# EAGLE design usb-db-revC (EAGLE 9.6.2)
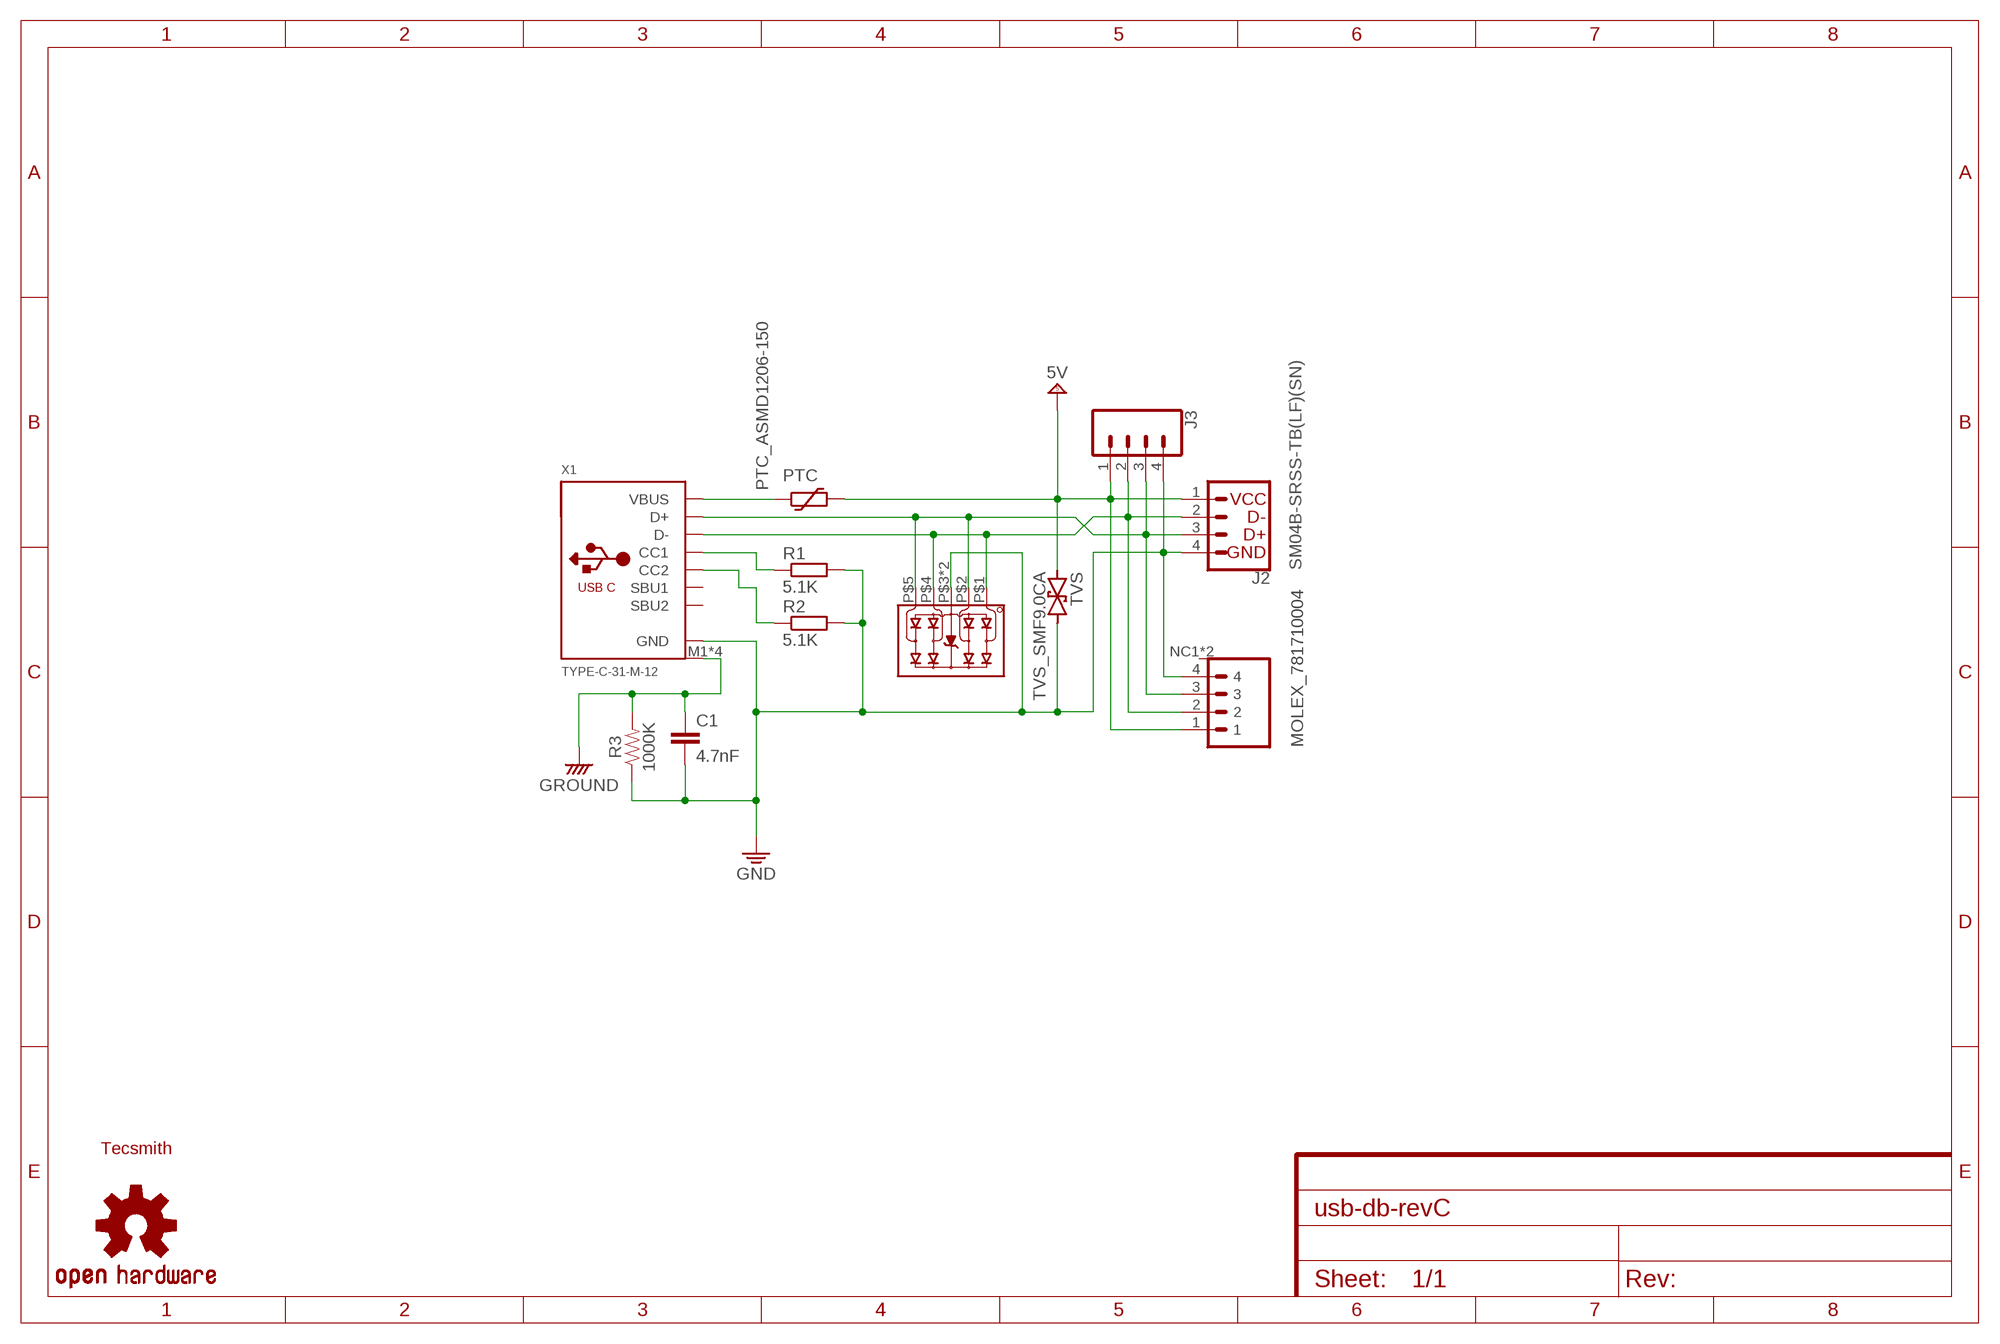
[diagram p0: schematic, sheet 1]

## Parts
C1  4.7nF  0.1UF-0603-25V-5%  [0603]
J2  SM04B-SRSS-TB(LF)(SN)  C3_UNIFIEDJS-1MM  [1X04_1MM_RA]
J3  CONN_04SMD_RA_FEMALE  [1X04_SMD_RA_FEMALE]
LOGO1  OSHW-LOGOS  [OSHW-LOGO-S]
MOLEX_781710004  MOLEX_0781710004  [MOLEX_781710004]
PTC  PTC_ASMD1206-150  PTC_ASMD1206  [SMD_PTC]
R1  5.1K  R-EU_R0402  [R0402]
R2  5.1K  R-EU_R0402  [R0402]
R3  1000K  75KOHM-0603-1/10W-1%  [0603]
TVS  TVS_SMF9.0CA  [SOD123FL-BI]
U$2  TECSMITH-LOGOSHORT  [TECSMITH-CUBE]
X1  TYPE-C-31-M-12  USB_C  [TYPE-C-31-M-12]
Y1  ESD_TPD4E05U06  [DQA-10-PIN]

## Nets
CC1: R1.1 X1.A5-CC1(CC1)
CC2: R2.1 X1.B5-CC2(CC2)
D_N: J2.2(D-) J3.2 MOLEX_781710004.2 X1.A7-DN1(D-) X1.B7-DN2(D-) Y1.P$1(D1+) Y1.P$4(D2+)
D_P: J2.3(D+) J3.3 MOLEX_781710004.3 X1.A6-DP1(D+) X1.B6-DP2(D+) Y1.P$2(D1-) Y1.P$5(D2-)
GND: C1.2 J2.4(GND) J3.4 MOLEX_781710004.4 R1.2 R2.2 R3.1 TVS.P$2 X1.A1B12-GND(GND) X1.B1A12-GND(GND) Y1.P$3(GND) Y1.P$8(GND)
GROUND: C1.1 R3.2 X1.M1(SHIELD) X1.M2(SHIELD) X1.M3(SHIELD) X1.M4(SHIELD)
VBUS: PTC.P$1 X1.A4B9-VBUS(VBUS) X1.B4A9-VBUS(VBUS)
VSUP: J2.1(VCC) J3.1 MOLEX_781710004.1 PTC.P$2 TVS.P$1 ; supply symbol labelled 5V
Unconnected: MOLEX_781710004.NC1(M) MOLEX_781710004.NC2(M) X1.A8-SBU1(SBU1) X1.B8-SBU2(SBU2)

## Library data of the parts
C1 = SparkFun-Capacitors:0.1UF: 0.1µF ceramic capacitors A capacitor is a passive two-terminal electrical component used to store electrical energy temporarily in an electric field.; PROD_ID: CAP-08604; VALUE: 0.1uF
J2 = __untitled:C3_UNIFIED: SparkFun I2C Standard Qwiic Connector An SMD 1mm pitch JST connector makes it easy and quick (get it? Qwiic?) to connect I2C devices to each other. The Qwiic system <http://www.sparkfun.com/qwiic> enables fast and solderless connection between popular platforms and various sensors and actuators. We carry 200mm <https://www.sparkfun.com/products/14204>, 100mm <https://www.sparkfun.com/products/14205>, 50mm <https://www.sparkfun.com/products/14206>, and breadboard friendly <https://www.sparkfun.com/products/14207> Qwiic cables. We also offer 10 pcs strips <https://www.sparkfun.com/products/14323> the SMD connectors.
J3 = __untitled:CONN_04: Multi connection point. Often used as Generic Header-pin footprint for 0.1 inch spaced/style header connections On any of the 0.1 inch spaced packages, you can populate with these: Break Away Headers - Straight <https://www.sparkfun.com/products/116> (PRT-00116) Break Away Male Headers - Right Angle <https://www.sparkfun.com/products/553> (PRT-00553) Female Headers <https://www.sparkfun.com/products/115> (PRT-00115) Break Away Headers - Machine Pin <https://www.sparkfun.com/products/117> (PRT-00117) Break Away Female Headers - Swiss Machine Pin <https://www.sparkfun.com/products/743> (PRT-00743) For SCREWTERMINALS and SPRING TERMINALS visit here: Screw Terimnals on SparkFun.com <https://www.sparkfun.com/search/results?term=Screw+Terminals> (5mm/3.5mm/2.54mm spacing) This device is also useful as a general connection point to wire up your design to another part of your project. Our various solder wires solder well into these plated through hole pads. Hook-Up Wire - Assortment (Stranded, 22 AWG) <https://www.sparkfun.com/products/11375> (PRT-11375) Hook-Up Wire - Assortment (Solid Core, 22 AWG) <https://www.sparkfun.com/products/11367> (PRT-11367) View the entire wire category on our website here <https://www.sparkfun.com/categories/141> Special notes: Molex polarized connector foot print use with SKU : PRT-08231 with associated crimp pins and housings. 1MM SMD Version SKU: PRT-10208; PROD_ID: CONN-12382
LOGO1 = SparkFun-Aesthetics:OSHW-LOGO: Open-Source Hardware (OSHW) Logo This logo indicates the piece of hardware it is found on incorporates a OSHW license and/or adheres to the definition of open source hardware found here: http://freedomdefined.org/OSHW
MOLEX_781710004 = molex-pico-ezmate:MOLEX_0781710004: SMD 1.2mm pitch Molex Pico-EZmate 4P connector
PTC = ts_keyboards:PTC_ASMD1206
R1 R2 = rcl:R-EU_: RESISTOR, European symbol; SPICEPREFIX: R
R3 = SparkFun-Resistors:75KOHM: 75Ω resistor A resistor is a passive two-terminal electrical component that implements electrical resistance as a circuit element. Resistors act to reduce current flow, and, at the same time, act to lower voltage levels within circuits. - Wikipedia; PROD_ID: RES-09737; VALUE: 75
TVS = ts_keyboards:TVS_SMF9.0CA
U$2 = random_logos:TECSMITH-LOGO
X1 = ts_keyboards:USB_C: USB Type-C USB 2.0 Connector
Y1 = ts_keyboards:ESD_TPD4E05U06

## Net classes
0 default: width 0 mm, drill 0 mm

## Board
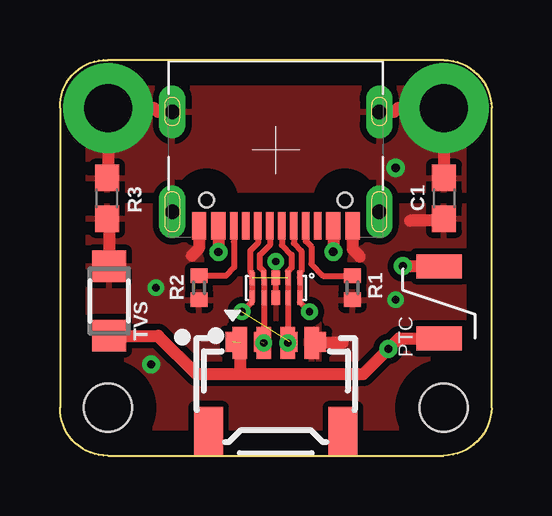
[diagram p1: board, top side]
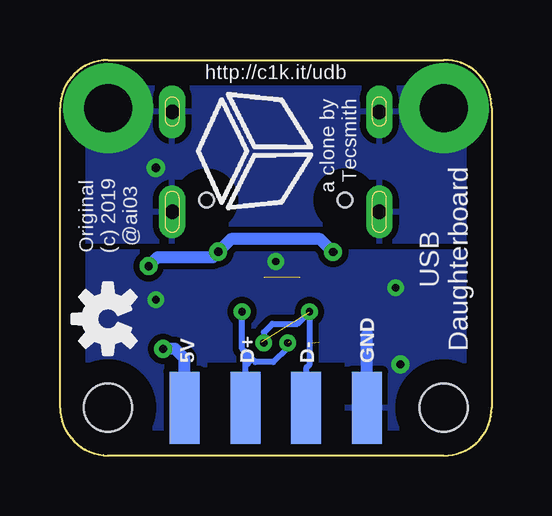
[diagram p2: board, bottom side, seen from below]

Size 18 x 16.5 mm. Coordinates in mm from the lower left corner, seen from the top.
Outline: 2,0 16,0 arc88 18,2 18,14.5 arc89 16,16.5 2,16.5 arc93 0,14.5 0,2 arc92 2,0
Copper layers (1*16): Top 0.035mm / dielectric 1.5mm / Bottom 0.035mm
Design rules "default *": minimum track width 6mil, minimum drill 0.3mm, track to track 6mil, track to pad 6mil, pad to pad 6mil, via to via 6mil, smd to smd 6mil, copper to edge 40mil, drill to drill 6mil, minimum pad ring 10mil, minimum via ring 8mil, stop-mask expansion 4mil, vias tented up to drill 0mil, thermal gap 10mil
Holes 2 mm at 2,2 16,2
tKeepout: area 0,0 to 4,4; area 14,0 to 18,4
bKeepout: area 0,0 to 4,4; area 14,0 to 18,4

### Footprints (pad centres in the part's own frame; a part is rotated, then mirrored left to right if it is on the bottom)
0603 = smd 1.1 x 1: 1 -0.85,0; 2 0.85,0
1X04_1MM_RA = smd 0.6 x 1.35: 1 -1.5,0; 2 -0.5,0; 3 0.5,0; 4 1.5,0 | smd 1.2 x 2: NC1 2.8,-3.675; NC2 -2.8,-3.675
1X04_SMD_RA_FEMALE = smd 1.25 x 3: 1 -3.81,0; 2 -1.27,0; 3 1.27,0; 4 3.81,0
MOLEX_781710004 = smd 0.6 x 0.85: 1 -1.8,2; 2 -0.6,2; 3 0.6,2; 4 1.8,2 | smd 0.7 x 0.8: NC1 -2.95,-1.775; NC2 2.95,-1.775
SMD_PTC = smd 1 x 1.9: P$1 -1.5,0; P$2 1.5,0
R0402 = smd 0.6 x 0.7: 1 -0.5,0; 2 0.5,0
SOD123FL-BI = smd 1.3 x 1.4: P$1 -1.45,0; P$2 1.45,0
TYPE-C-31-M-12 = smd 0.6 x 1.14: A1B12-GND -3.2,3.16; A4B9-VBUS -2.4,3.16; B1A12-GND 3.2,3.16; B4A9-VBUS 2.4,3.16 | smd 0.3 x 1.14: A5-CC1 -1.25,3.16; A6-DP1 -0.25,3.16; A7-DN1 0.25,3.16; A8-SBU1 1.25,3.16; B5-CC2 1.75,3.16; B6-DP2 0.75,3.16; B7-DN2 -0.75,3.16; B8-SBU2 -1.75,3.16 | drill 0.6 pad 1 long: M1 -4.32,2.59; M2 4.32,2.59; M3 -4.32,-1.59; M4 4.32,-1.59 | hole 0.6: 2.89,2.09; -2.89,2.09
DQA-10-PIN = smd 0.565 x 0.2: P$1 -0.417,1; P$2 -0.417,0.5; P$4 -0.417,-0.5; P$5 -0.417,-1; P$6 0.417,-1; P$7 0.417,-0.5; P$9 0.417,0.5; P$10 0.417,1 | smd 0.565 x 0.36: P$3 -0.417,0; P$8 0.417,0

### Placement (x,y rotation side)
C1  16.02,10.73 270 top
J2  9,4.7 0 top
J3  9,2 0 bottom
LOGO1  16,5.7 90 bottom
MOLEX_781710004  9,2.74 0 top
PTC  15.81,6.39 270 top
R1  12.2,7 270 top
R2  5.8,7 270 top
R3  1.96,10.73 90 top
TVS  2.05,6.45 90 top
U$2  10,12.7 90 bottom
X1  9,12.75 180 top
Y1  9,7 270 top

### Tracks (layer width: path | path; a pad name or v marks a point on that pad's centre or on a via)
CC1
  Top 0.254: X1.A5-CC1 10.25,8.94 10.48,8.71 10.48,7.99 10.97,7.5 R1.1
CC2
  Top 0.254: X1.B5-CC2 7.25,8.91 7.27,8.89 7.27,7.85 6.92,7.5 R2.1
D_N  (via drill 0.3, 0.3 pad 0.5)  (1 unrouted)
  Top 0.254: X1.A7-DN1 8.75,8.78 8.34,8.37 8.34,7.84 8.5,7.68 Y1.P$4 J2.2 | X1.B7-DN2 9.75,8.86 10.07,8.54 10.07,7.69 10,7.62 Y1.P$1 10,6.4 v10.4,6
  Bottom 0.254: J2.2 8.5,4.5 9.1,3.9 9.85,3.9 9.98,4.03 | v10.4,6 10.4,4.45 10.27,4.32 | 9.98,4.03 10.27,4.32 | J3.2 10.27,3.74 | 10.27,3.74 9.98,4.03 | 10.27,3.74 10.27,4.32
  other vias: 8.5,4.7
D_P  (via drill 0.3)  (2 unrouted)
  Top 0.254: X1.A6-DP1 9.25,8.78 9.66,8.37 9.66,7.84 9.5,7.68 J2.3 | X1.B6-DP2 8.25,8.86 7.93,8.54 7.93,7.69 8,7.62 Y1.P$5 8,6.4 v7.6,6
  Bottom 0.254: J2.3 9.5,5.14 9.14,5.5 8.1,5.5 v7.6,6 7.6,3.78 7.73,3.65 J3.3
  other vias: 9.5,4.7
GND  (via drill 0.3, 0.3 pad 0.55, 0.35)
  Top 0.254: Y1.P$8 Y1.P$3 v9,8.1
  Top 0.508: 11.8,4.7 J2.4 | X1.B1A12-GND 5.8,8.64 5.5,8.34 | X1.A1B12-GND 12.2,8.61 12.51,8.3 | R3.1 2.05,9.79 TVS.P$2 | C1.2 15.94,9.8 14.6,9.8
  Bottom 0.508: J3.4 5.19,5.04
  other vias: 4,7 14,6.5 3.8,3.8
  pour Top (isolate 0.254): 0,10.4 4.74,10.4 4.74,9.12 13.37,9.12 13.37,10.4 18,10.4 18,0 0,0
  pour Bottom (isolate 0.254): 0,0 6,0 6,4 12,4 12,0 18,0 18,8.5 0,8.5
GROUND  (via drill 0.35, 2 pad 3.75)
  Top 0.508: X1.M3 13.94,14.34 14.1,14.5 v16,14.5 16,11.6 C1.1 | R3.2 2.01,11.63 v2.01,14.49 v2,14.5 3.92,14.5 4.08,14.34 X1.M4
  other vias: 14,12
  pour Bottom (isolate 0.254): 0,8.95 18,8.95 18,16.5 0,16.5
  pour Top (isolate 0.254): 0,16.5 0,11.1 18,11.1 18,16.5
VBUS  (via drill 0.35)
  Top 0.508: X1.A4B9-VBUS v11.4,8.5 | X1.B4A9-VBUS v6.61,8.49 | v14.3,7.9 PTC.P$1
  Bottom 0.508: v6.61,8.49 7.15,9.03 10.87,9.03 v11.4,8.5 11.62,8.28 13.92,8.28 v14.3,7.9
VSUP  (via drill 0.35)  (1 unrouted)
  Top 0.508: TVS.P$1 4.1,5 5.7,3.4 7.5,3.4 | J2.1 7.5,3.4 | 7.5,3.4 12.65,3.4 v13.7,4.45 14.14,4.89 PTC.P$2
  Bottom 0.508: J3.1 12.81,4.06 13.2,4.45 v13.7,4.45

### Text on the board
tPlace: PTC
bPlace: http://c1k.it/udb | a clone by / Tecsmith | Original / (c) 2019 / @ai03 | USB / Daughterboard
bNames: GND | D- | D+ | 5V